# Altium schematic sheet DDR3.SchDoc
size A4; SheetNumber: 4; SheetTotal: 6
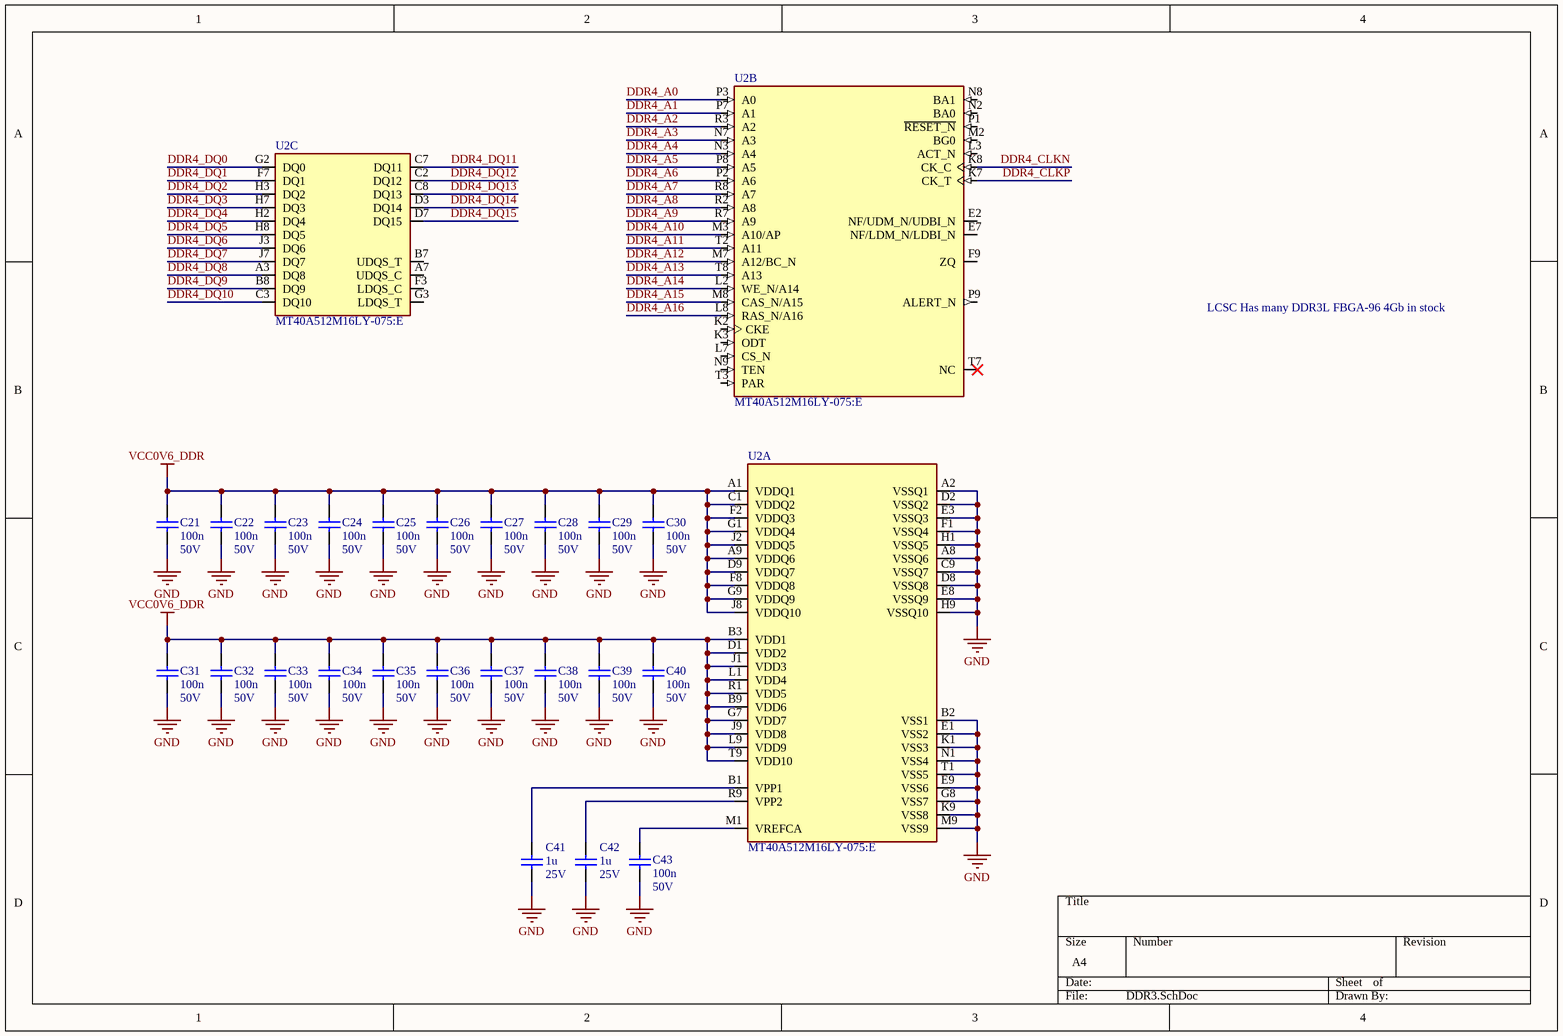
[diagram p0: DDR3.SchDoc]

## Parts
C21  value 100n  Voltage: 50V  [GRM155R71H104KE14D]  (hidden comment: GRM155R71H104KE14D)
C22  value 100n  Voltage: 50V  [GRM155R71H104KE14D]  (hidden comment: GRM155R71H104KE14D)
C23  value 100n  Voltage: 50V  [GRM155R71H104KE14D]  (hidden comment: GRM155R71H104KE14D)
C24  value 100n  Voltage: 50V  [GRM155R71H104KE14D]  (hidden comment: GRM155R71H104KE14D)
C25  value 100n  Voltage: 50V  [GRM155R71H104KE14D]  (hidden comment: GRM155R71H104KE14D)
C26  value 100n  Voltage: 50V  [GRM155R71H104KE14D]  (hidden comment: GRM155R71H104KE14D)
C27  value 100n  Voltage: 50V  [GRM155R71H104KE14D]  (hidden comment: GRM155R71H104KE14D)
C28  value 100n  Voltage: 50V  [GRM155R71H104KE14D]  (hidden comment: GRM155R71H104KE14D)
C29  value 100n  Voltage: 50V  [GRM155R71H104KE14D]  (hidden comment: GRM155R71H104KE14D)
C30  value 100n  Voltage: 50V  [GRM155R71H104KE14D]  (hidden comment: GRM155R71H104KE14D)
C31  value 100n  Voltage: 50V  [GRM155R71H104KE14D]  (hidden comment: GRM155R71H104KE14D)
C32  value 100n  Voltage: 50V  [GRM155R71H104KE14D]  (hidden comment: GRM155R71H104KE14D)
C33  value 100n  Voltage: 50V  [GRM155R71H104KE14D]  (hidden comment: GRM155R71H104KE14D)
C34  value 100n  Voltage: 50V  [GRM155R71H104KE14D]  (hidden comment: GRM155R71H104KE14D)
C35  value 100n  Voltage: 50V  [GRM155R71H104KE14D]  (hidden comment: GRM155R71H104KE14D)
C36  value 100n  Voltage: 50V  [GRM155R71H104KE14D]  (hidden comment: GRM155R71H104KE14D)
C37  value 100n  Voltage: 50V  [GRM155R71H104KE14D]  (hidden comment: GRM155R71H104KE14D)
C38  value 100n  Voltage: 50V  [GRM155R71H104KE14D]  (hidden comment: GRM155R71H104KE14D)
C39  value 100n  Voltage: 50V  [GRM155R71H104KE14D]  (hidden comment: GRM155R71H104KE14D)
C40  value 100n  Voltage: 50V  [GRM155R71H104KE14D]  (hidden comment: GRM155R71H104KE14D)
C41  value 1u  Voltage: 25V  [GRM155R61E105KA12D]  (hidden comment: GRM155R61E105KA12D)
C42  value 1u  Voltage: 25V  [GRM155R61E105KA12D]  (hidden comment: GRM155R61E105KA12D)
C43  value 100n  Voltage: 50V  [GRM155R71H104KE14D]  (hidden comment: GRM155R71H104KE14D)
U2  MT40A512M16LY-075:E  (parts A,B,C of 3)

## Nets
GND: C21.2 C22.2 C23.2 C24.2 C25.2 C26.2 C27.2 C28.2 C29.2 C30.2 C31.2 C32.2 C33.2 C34.2 C35.2 C36.2 C37.2 C38.2 C39.2 C40.2 C41.2 C42.2 C43.2 U2.A2(VSSQ1) U2.A8(VSSQ6) U2.B2(VSS1) U2.C9(VSSQ7) U2.D2(VSSQ2) U2.D8(VSSQ8) U2.E1(VSS2) U2.E3(VSSQ3) U2.E8(VSSQ9) U2.E9(VSS6) U2.F1(VSSQ4) U2.G8(VSS7) U2.H1(VSSQ5) U2.H9(VSSQ10) U2.K1(VSS3) U2.K9(VSS8) U2.M9(VSS9) U2.N1(VSS4) U2.T1(VSS5)
VCC0V6_DDR: C21.1 C22.1 C23.1 C24.1 C25.1 C26.1 C27.1 C28.1 C29.1 C30.1 C31.1 C32.1 C33.1 C34.1 C35.1 C36.1 C37.1 C38.1 C39.1 C40.1 U2.A1(VDDQ1) U2.A9(VDDQ6) U2.B3(VDD1) U2.B9(VDD6) U2.C1(VDDQ2) U2.D1(VDD2) U2.D9(VDDQ7) U2.F2(VDDQ3) U2.F8(VDDQ8) U2.G1(VDDQ4) U2.G7(VDD7) U2.G9(VDDQ9) U2.J1(VDD3) U2.J2(VDDQ5) U2.J8(VDDQ10) U2.J9(VDD8) U2.L1(VDD4) U2.L9(VDD9) U2.R1(VDD5) U2.T9(VDD10)
DDR4_A0: U2.P3(A0)
DDR4_A1: U2.P7(A1)
DDR4_A2: U2.R3(A2)
DDR4_A3: U2.N7(A3)
DDR4_A4: U2.N3(A4)
DDR4_A5: U2.P8(A5)
DDR4_A6: U2.P2(A6)
DDR4_A7: U2.R8(A7)
DDR4_A8: U2.R2(A8)
DDR4_A9: U2.R7(A9)
DDR4_A10: U2.M3(A10/AP)
DDR4_A11: U2.T2(A11)
DDR4_A12: U2.M7(A12/BC_N)
DDR4_A13: U2.T8(A13)
DDR4_A14: U2.L2(WE_N/A14)
DDR4_A15: U2.M8(CAS_N/A15)
DDR4_A16: U2.L8(RAS_N/A16)
DDR4_CLKN: U2.K8(CK_C)
DDR4_CLKP: U2.K7(CK_T)
DDR4_DQ0: U2.G2(DQ0)
DDR4_DQ1: U2.F7(DQ1)
DDR4_DQ2: U2.H3(DQ2)
DDR4_DQ3: U2.H7(DQ3)
DDR4_DQ4: U2.H2(DQ4)
DDR4_DQ5: U2.H8(DQ5)
DDR4_DQ6: U2.J3(DQ6)
DDR4_DQ7: U2.J7(DQ7)
DDR4_DQ8: U2.A3(DQ8)
DDR4_DQ9: U2.B8(DQ9)
DDR4_DQ10: U2.C3(DQ10)
DDR4_DQ11: U2.C7(DQ11)
DDR4_DQ12: U2.C2(DQ12)
DDR4_DQ13: U2.C8(DQ13)
DDR4_DQ14: U2.D3(DQ14)
DDR4_DQ15: U2.D7(DQ15)
NetC41_1: C41.1 U2.B1(VPP1)
NetC42_1: C42.1 U2.R9(VPP2)
NetC43_1: C43.1 U2.M1(VREFCA)

Not connected (* = marked no-connect by the designer): U2 A7(UDQS_C) B7(UDQS_T) E2(NF/UDM_N/UDBI_N) E7(NF/LDM_N/LDBI_N) F3(LDQS_C) F9(ZQ) G3(LDQS_T) K2(CKE) K3(ODT) L3(ACT_N) L7(CS_N) M2(BG0) N2(BA0) N8(BA1) N9(TEN) P1(~{RESET_N}) P9(ALERT_N) T3(PAR) T7(NC)*

## Notes on the sheet
- LCSC Has many DDR3L FBGA-96 4Gb in stock

## Library data of the parts
C21-C40 C43 = GRM155R71H104KE14D: CAP 100N 50V X7R 0402; Size: 0402; Dielectric: X7R; Manufacturer Part Number 1: GRM155R71H104KE14D
C41 C42 = GRM155R61E105KA12D: CAP 1U 25V X5R 0402; Size: 0402; Dielectric: X5R; Manufacturer Part Number 1: GRM155R61E105KA12D
U2 = MT40A512M16LY-075:E: SDRAM - DDR4 Memory IC 8Gb (512M x 16) Parallel 1.33 GHz 96-FBGA (7.5x13.5); MF: Micron Technology Inc.; SnapEDA_Link: https://www.snapeda.com/parts/MT40A512M16LY-075:E/Micron/view-part/?ref=snap; Package: TFBGA-96 Micron Technology; Value: *; MP: MT40A512M16LY-075:E; Check_prices: https://www.snapeda.com/parts/MT40A512M16LY-075:E/Micron/view-part/?ref=eda